# EAGLE schematic Pop-Up 5.3 (EAGLE 7.2.0)
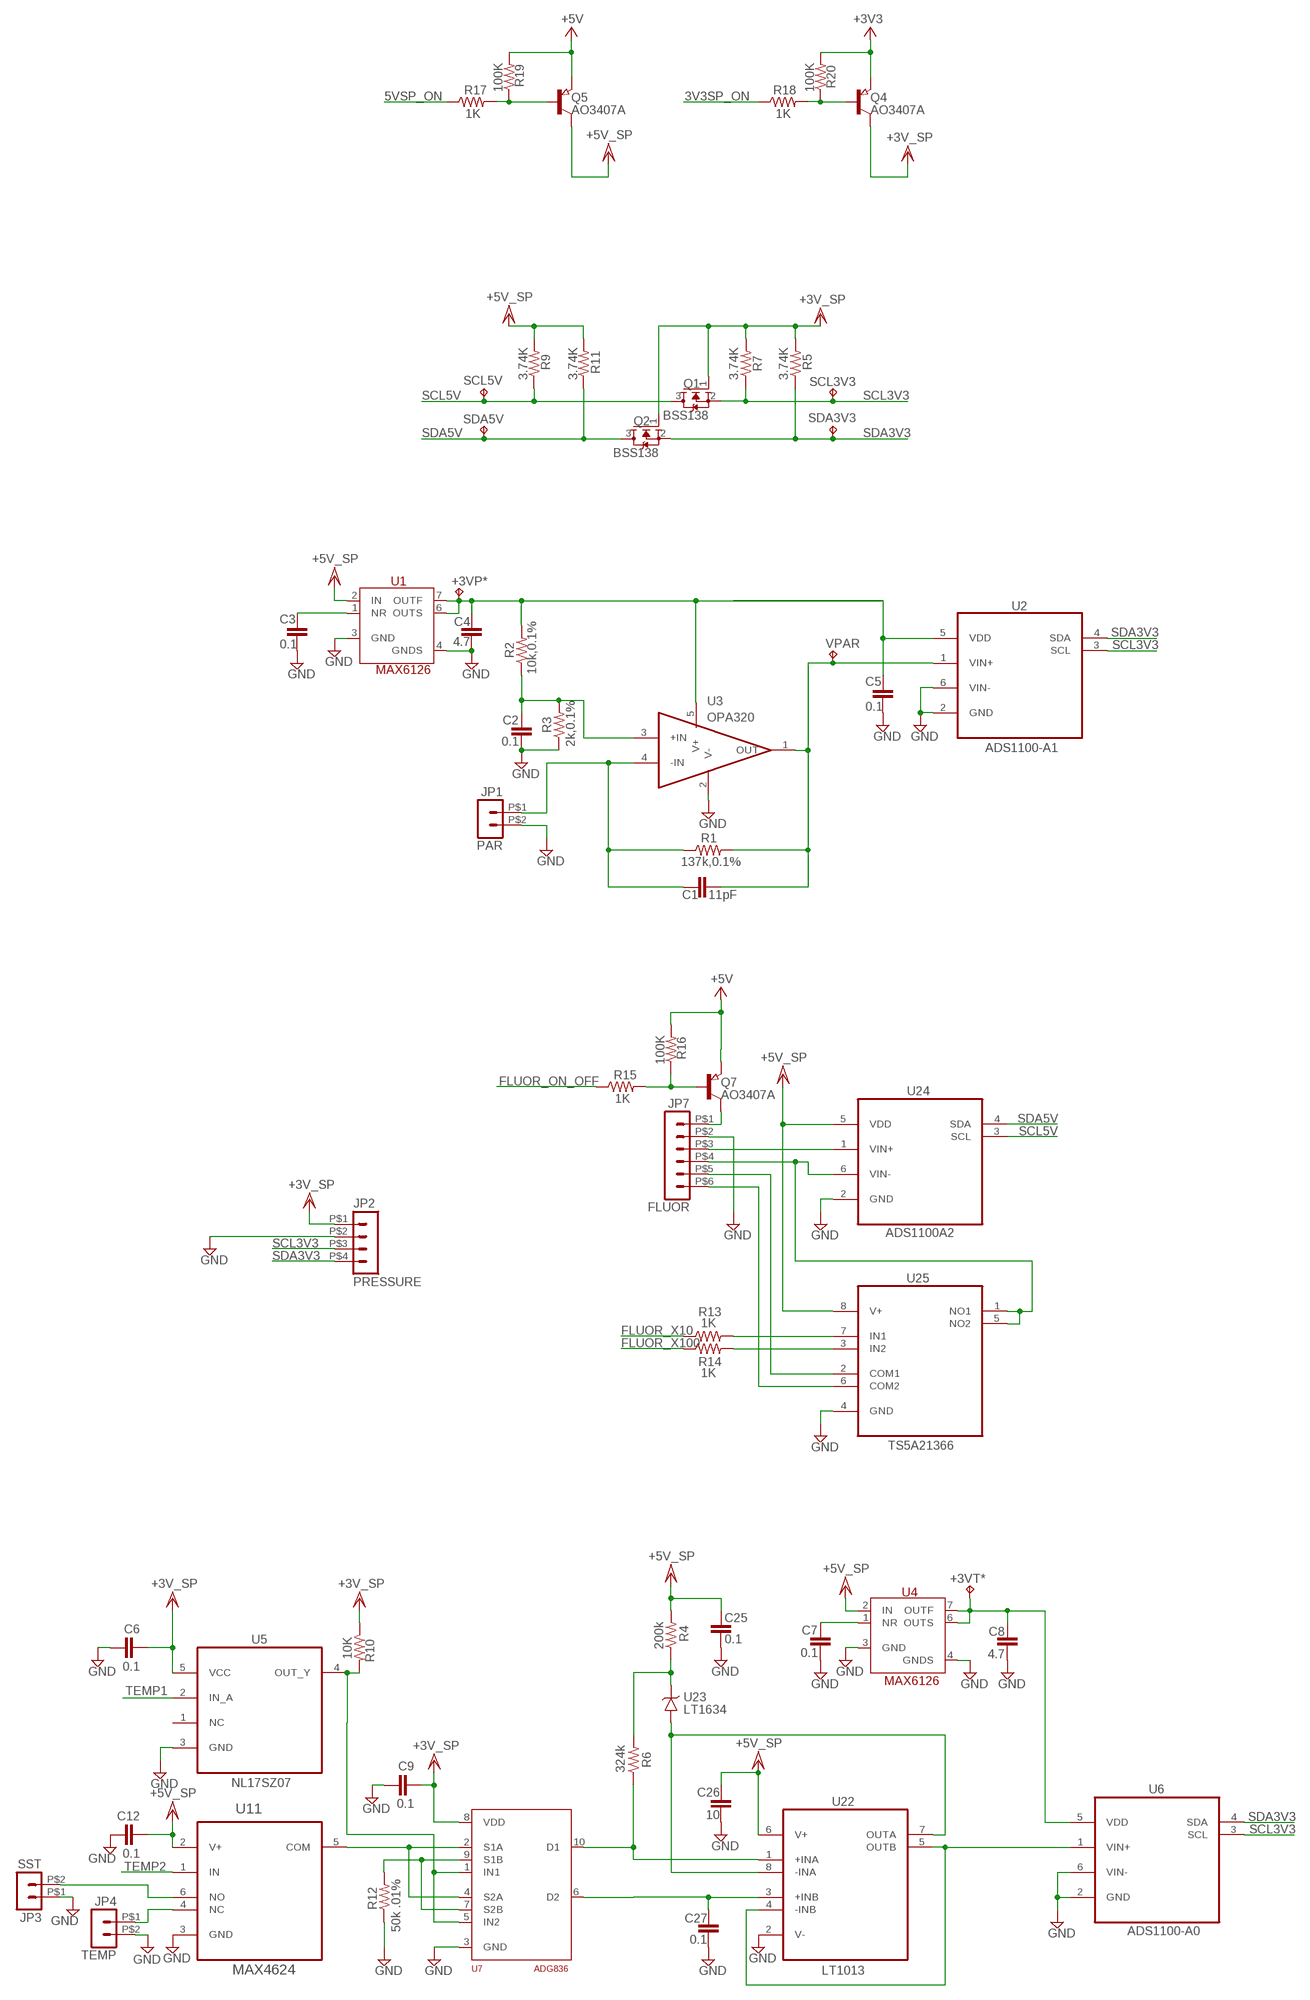
[diagram p0: schematic, sheet 1, part 1 of 2]
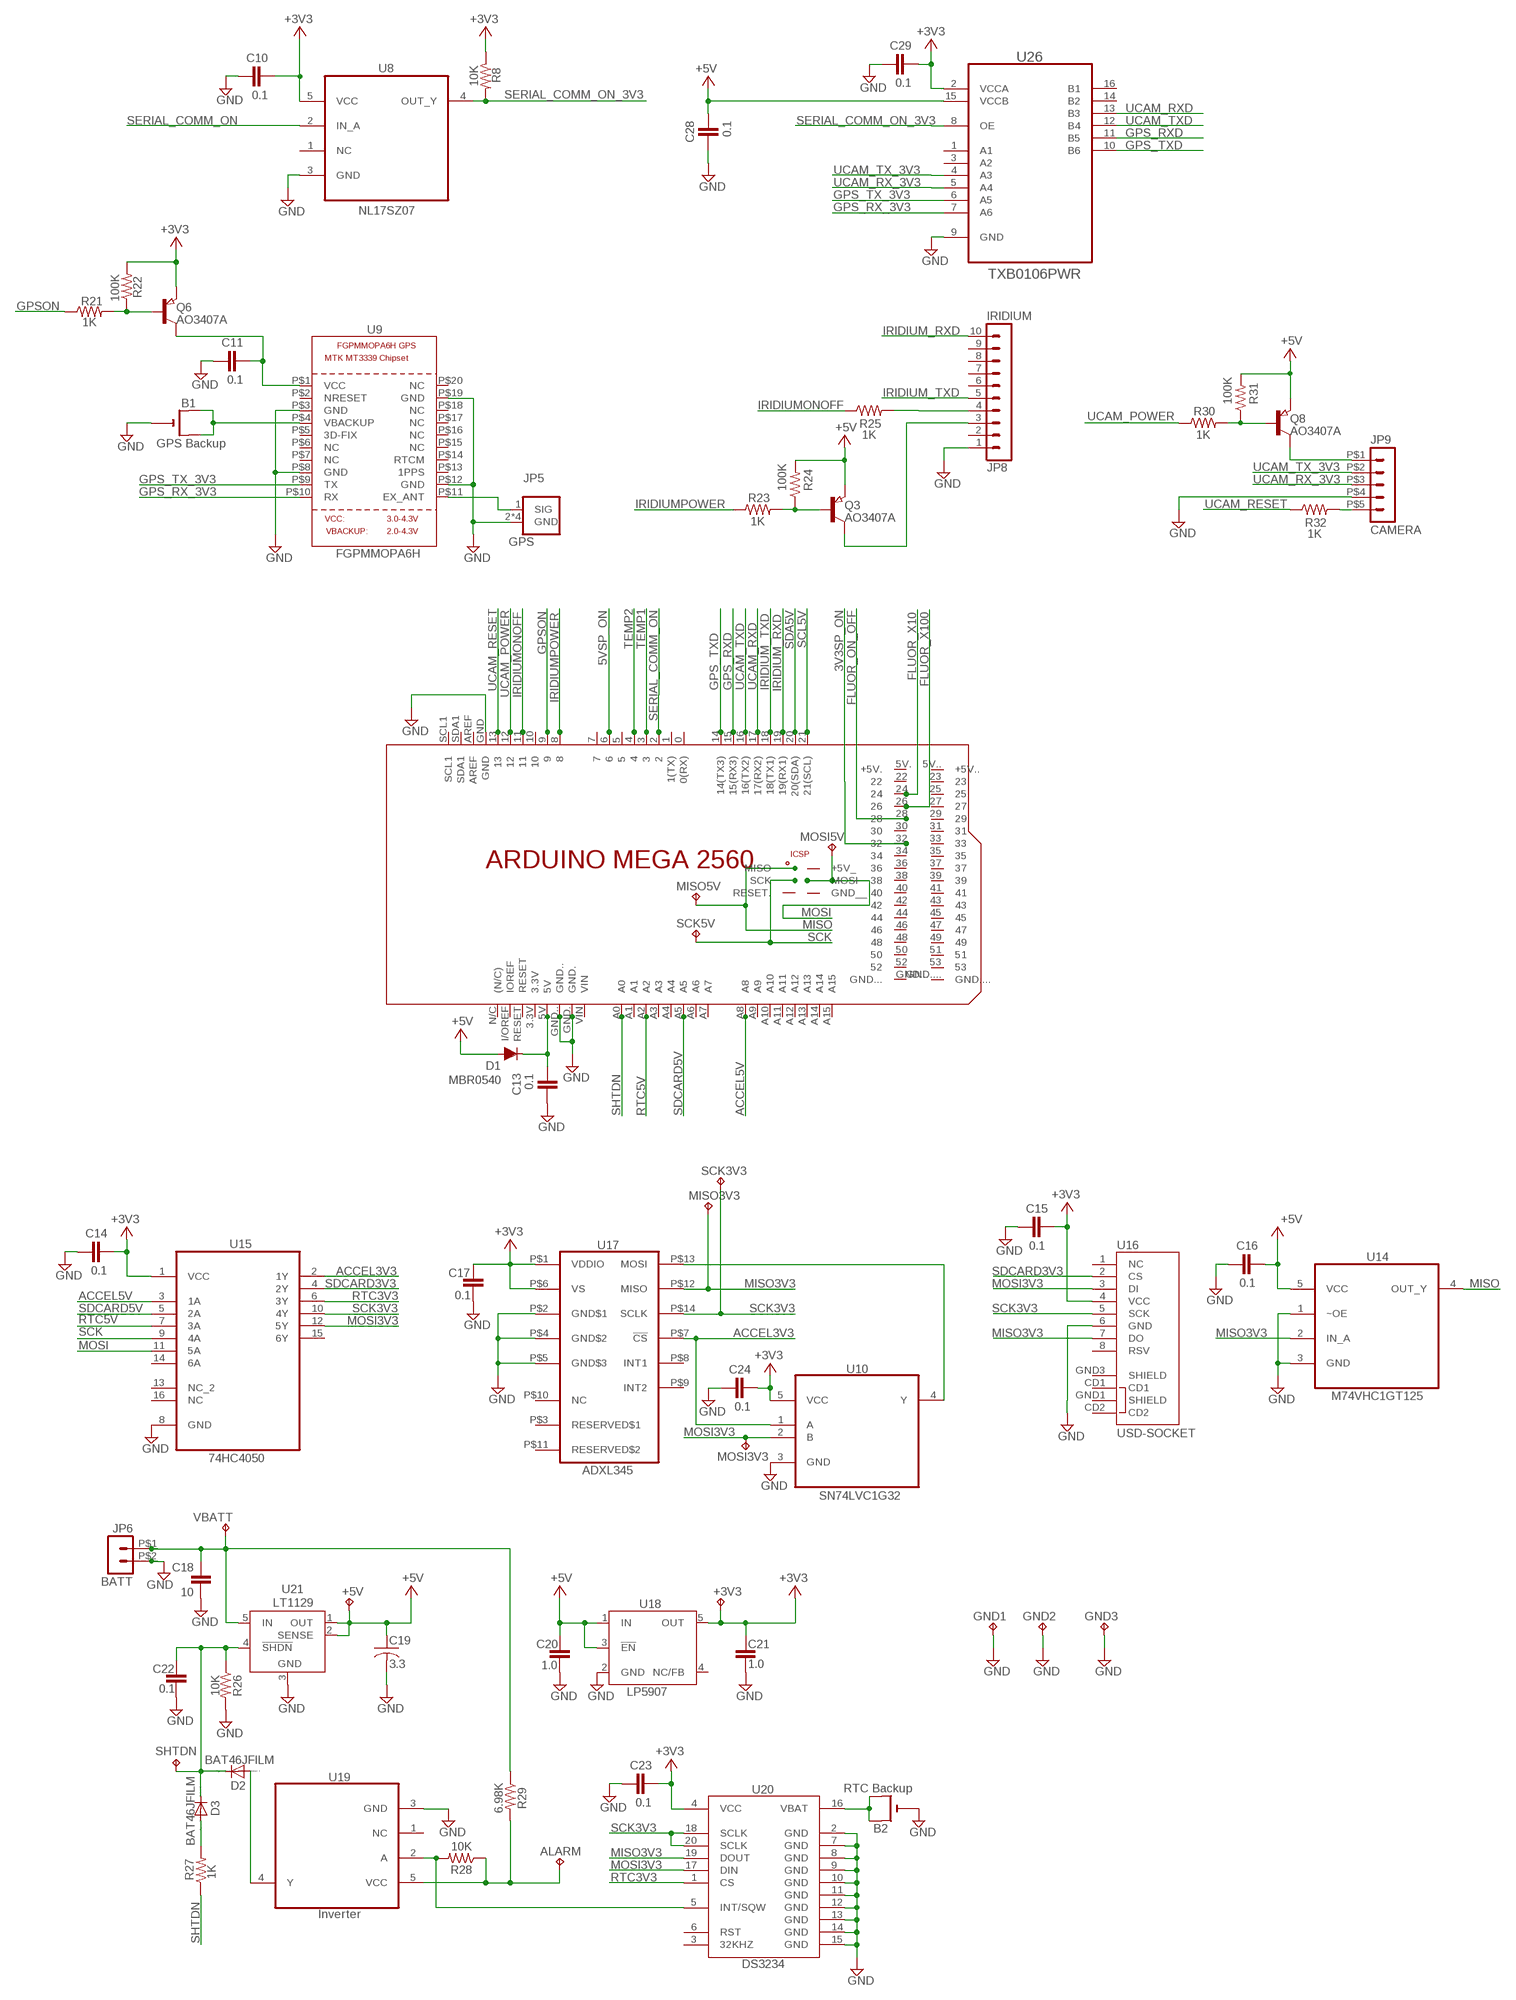
[diagram p1: schematic, sheet 1, part 2 of 2]

## Parts
+3V3  TP-040  [TP-040]
+3VP*  TP-040  [TP-040]
+3VT*  TP-040  [TP-040]
+5V  TP-040  [TP-040]
ALARM  TP-040  [TP-040]
B1  GPS Backup  CR1220SMT  [CR1220-SMD]
B2  RTC Backup  CR1220SMT  [CR1220-SMD]
C1  11pF  CAP0603-CAP  [0603-CAP]
C2  0.1  CAP0603-CAP  [0603-CAP]
C3  0.1  CAP0603-CAP  [0603-CAP]
C4  4.7  CAP0603-CAP  [0603-CAP]
C5  0.1  CAP0603-CAP  [0603-CAP]
C6  0.1  CAP0603-CAP  [0603-CAP]
C7  0.1  CAP0603-CAP  [0603-CAP]
C8  4.7  CAP0603-CAP  [0603-CAP]
C9  0.1  CAP0603-CAP  [0603-CAP]
C10  0.1  CAP0603-CAP  [0603-CAP]
C11  0.1  CAP0603-CAP  [0603-CAP]
C12  0.1  CAP0603-CAP  [0603-CAP]
C13  0.1  CAP0603-CAP  [0603-CAP]
C14  0.1  CAP0603-CAP  [0603-CAP]
C15  0.1  CAP0603-CAP  [0603-CAP]
C16  0.1  CAP0603-CAP  [0603-CAP]
C17  0.1  CAP0603-CAP  [0603-CAP]
C18  10  C-EUC1206  [C1206]
C19  3.3  C-USC1206  [C1206]
C20  1.0  CAP0603-CAP  [0603-CAP]
C21  1.0  CAP0603-CAP  [0603-CAP]
C22  0.1  CAP0603-CAP  [0603-CAP]
C23  0.1  CAP0603-CAP  [0603-CAP]
C24  0.1  CAP0603-CAP  [0603-CAP]
C25  0.1  CAP0603-CAP  [0603-CAP]
C26  10  C-EUC1206  [C1206]
C27  0.1  CAP0603-CAP  [0603-CAP]
C28  0.1  CAP0603-CAP  [0603-CAP]
C29  0.1  CAP0603-CAP  [0603-CAP]
D1  MBR0540  D-FILL-SOD123  [SOD123]
D2  BAT46JFILM  DIODE-SOD323-R  [SOD323-R]
D3  BAT46JFILM  DIODE-SOD323-R  [SOD323-R]
GND1  TP-040  [TP-040]
GND2  TP-040  [TP-040]
GND3  TP-040  [TP-040]
JP1  PAR  HEADER_POS2_43650-0215  [43650-0215]
JP2  PRESSURE  HEADER_POS4_43650-0415  [43650-0415]
JP3  SST  HEADER_POS2_43650-0215  [43650-0215]
JP4  TEMP  HEADER_POS2_43650-0215  [43650-0215]
JP5  GPS  901-9895-RFX  [AMPHENOL_901-9895-RFX]
JP6  BATT  HEADER_POS2_43650-0215  [43650-0215]
JP7  FLUOR  HEADER_POS6_43045-0612  [43045-0612]
JP8  IRIDIUM  53398-1010  [53398-1010]
JP9  CAMERA  HEADER_POS5_43650-0515  [43650-0515]
MISO3V3  TP-040  [TP-040]
MISO5V  TP-040  [TP-040]
MOSI3V3  TP-040  [TP-040]
MOSI5V  TP-040  [TP-040]
Q1  BSS138  MOSFET-NREFLOW  [SOT23]
Q2  BSS138  MOSFET-NREFLOW  [SOT23]
Q3  AO3407A  PNP-TRANSISTOR_SOT23  [SOT23]
Q4  AO3407A  PNP-TRANSISTOR_SOT23  [SOT23]
Q5  AO3407A  PNP-TRANSISTOR_SOT23  [SOT23]
Q6  AO3407A  PNP-TRANSISTOR_SOT23  [SOT23]
Q7  AO3407A  PNP-TRANSISTOR_SOT23  [SOT23]
Q8  AO3407A  PNP-TRANSISTOR_SOT23  [SOT23]
R1  137k,0.1%  R-US_R0603  [R0603]
R2  10k,0.1%  R-US_R0603  [R0603]
R3  2k,0.1%  R-US_R0603  [R0603]
R4  200k  R-US_R1206  [R1206]
R5  3.74K  R-US_R0603  [R0603]
R6  324k  R-US_R1206  [R1206]
R7  3.74K  R-US_R0603  [R0603]
R8  10K  R-US_R0603  [R0603]
R9  3.74K  R-US_R0603  [R0603]
R10  10K  R-US_R0603  [R0603]
R11  3.74K  R-US_R0603  [R0603]
R12  50k .01%  R-US_R2010  [R2010]
R13  1K  R-US_R0603  [R0603]
R14  1K  R-US_R0603  [R0603]
R15  1K  R-US_R0603  [R0603]
R16  100K  R-US_R0603  [R0603]
R17  1K  R-US_R0603  [R0603]
R18  1K  R-US_R0603  [R0603]
R19  100K  R-US_R0603  [R0603]
R20  100K  R-US_R0603  [R0603]
R21  1K  R-US_R0603  [R0603]
R22  100K  R-US_R0603  [R0603]
R23  1K  R-US_R0603  [R0603]
R24  100K  R-US_R0603  [R0603]
R25  1K  R-US_R0603  [R0603]
R26  10K  R-US_R0603  [R0603]
R27  1K  R-US_R0603  [R0603]
R28  10K  R-US_R0603  [R0603]
R29  6.98K  R-US_R0603  [R0603]
R30  1K  R-US_R0603  [R0603]
R31  100K  R-US_R0603  [R0603]
R32  1K  R-US_R0603  [R0603]
SCK3V3  TP-040  [TP-040]
SCK5V  TP-040  [TP-040]
SCL3V3  TP-040  [TP-040]
SCL5V  TP-040  [TP-040]
SDA3V3  TP-040  [TP-040]
SDA5V  TP-040  [TP-040]
SHTDN  TP-040  [TP-040]
U1  MAX6126  [SOIC127P600X175-8N]
U2  ADS1100-A1  ADS1100A0IDBVT  [SOT95P280X145-6N]
U3  OPA320  OPA320AIDBVT  [SOT95P280X145-5N]
U4  MAX6126  [SOIC127P600X175-8N]
U5  NL17SZ07  NL17SZ07DFT2G  [SOT65P210X110-5N]
U6  ADS1100-A0  ADS1100A0IDBVT  [SOT95P280X145-6N]
U7  ADG836  [MSOP10]
U8  NL17SZ07  NL17SZ07DFT2G  [SOT65P210X110-5N]
U9  FGPMMOPA6H  GPS_FGPMMOPA6H  [FGPMMOPA6H]
U10  SN74LVC1G32  SN74LVC1G32DCKT  [SOT65P210X110-5N]
U11  MAX4624  MAX4624EZT+T  [SOT95P275X100-6N]
U12  Arduino MEGA2650  MEGA2650_UPSIDEDOWNMOUNT  [MEGA2650_UPSIDEDOWNMOUNT]
U14  M74VHC1GT125  M74VHC1GT125DF1G  [SOT65P210X110-5N]
U15  74HC4050  M74HC4050RM13TR  [SOIC127P600X175-16N]
U16  USD-SOCKET  [MICROSD_1:1]
U17  ADXL345  [LGA14]
U18  LP5907  TPS77033  [SOT23-DBV]
U19  Inverter  1P1G14MDBVREPG4  [SOT95P280X145-5N]
U20  DS3234  [DS3234]
U21  LT1129  LT1129CQ-5  [Q5-DD]
U22  LT1013  LT1013IS8PBF  [SOIC127P600X175-8N]
U23  LT1634  LT1634BIS8-1.25  [S8]
U24  ADS1100A2  ADS1100A2IDBVT  [SOT95P280X145-6N]
U25  TS5A21366  TS5A21366DCUR  [SOP50P310X90-8N]
U26  TXB0106PWR  [SOP65P640X120-16N]
VBATT  TP-040  [TP-040]
VPAR  TP-040  [TP-040]

## Nets
3V3SP_ON: R18.1 U12.32
5VSP_ON: R17.1 U12.6
+3V3: +3V3.1 C10.1 C14.1 C15.1 C17.1 C21.1 C23.1 C24.1 C29.1 Q4.2(E) Q6.2(E) R8.1 R20.2 R22.2 U8.5(VCC) U10.5(VCC) U15.1(VCC) U16.4(VCC) U17.P$1(VDDIO) U17.P$6(VS) U18.5(OUT) U20.4(VCC) U26.2(VCCA)
+5V: +5V.1 C16.1 C19.1 C20.1 C28.1 D1.2(A) Q3.2(E) Q5.2(E) Q7.2(E) Q8.2(E) R16.2 R19.2 R24.2 R31.2 U14.5(VCC) U18.1(IN) U18.3(!EN) U21.1(OUT) U21.2(SENSE) U26.15(VCCB)
ACCEL3V3: U10.1(A) U15.2(1Y) U17.P$7(!CS)
ACCEL5V: U12.A8 U15.3(1A)
FLUOR_ON_OFF: R15.1 U12.28
FLUOR_X10: R13.1 U12.24
FLUOR_X100: R14.1 U12.26
GND: B1.- B2.- C2.2 C3.2 C4.2 C5.1 C6.2 C7.2 C8.2 C9.2 C10.2 C11.2 C12.2 C13.2 C14.2 C15.2 C16.2 C17.2 C18.2 C19.2 C20.2 C21.2 C22.2 C23.2 C24.2 C25.2 C26.2 C27.2 C28.2 C29.2 GND1.1 GND2.1 GND3.1 JP1.P$2 JP2.P$2 JP3.P$1 JP4.P$2 JP5.2(GND) JP5.3(GND) JP5.4(GND) JP5.5(GND) JP6.P$2 JP7.P$2 JP8.1 JP9.P$4 R3.1 R12.1 R26.2 U1.3(GND) U1.4(GNDS) U2.2(GND) U2.6(VIN-) U3.2(V-) U4.3(GND) U4.4(GNDS) U5.3(GND) U6.2(GND) U6.6(VIN-) U7.3(GND) U8.3(GND) U9.P$3(GND) U9.P$8(GND) U9.P$12(GND) U9.P$19(GND) U10.3(GND) U11.3(GND) U12.GND U12.GND. U12.GND.. U14.1(~OE) U14.3(GND) U15.8(GND) U16.6(GND) U17.P$2(GND$1) U17.P$4(GND$2) U17.P$5(GND$3) U18.2(GND) U19.3(GND) U20.2(GND) U20.7(GND) U20.8(GND) U20.9(GND) U20.10(GND) U20.11(GND) U20.12(GND) U20.13(GND) U20.14(GND) U20.15(GND) U21.3(GND) U22.2(V-) U24.2(GND) U25.4(GND) U26.9(GND)
GPS_RX_3V3: U9.P$10(RX) U26.7(A6)
GPS_RXD: U12.15(15(RX3)) U26.11(B5)
GPS_TX_3V3: U9.P$9(TX) U26.6(A5)
GPS_TXD: U12.14(14(TX3)) U26.10(B6)
GPSON: R21.1 U12.9
IRIDIUM_RXD: JP8.10 U12.19(19(RX1))
IRIDIUM_TXD: JP8.5 U12.18(18(TX1))
IRIDIUMONOFF: R25.1 U12.11
IRIDIUMPOWER: R23.1 U12.8
MISO: MISO5V.1 U12.MISO U14.4(OUT_Y)
MISO3V3: MISO3V3.1 U14.2(IN_A) U16.7(DO) U17.P$12(MISO) U20.19(DOUT)
MOSI: MOSI5V.1 U12.MOSI U15.11(5A)
MOSI3V3: MOSI3V3.1 U10.2(B) U15.12(5Y) U16.3(DI) U20.17(DIN)
N$1: D2.A U19.4(Y)
N$2: Q3.1(B) R23.2 R24.1
N$3: ALARM.1 R28.1 R29.2 U19.5(VCC)
N$4: JP8.4 R25.2
N$5: C7.1 U4.1(NR)
N$6: C13.1 D1.1(C) U12.5V
N$7: U7.2(S1A) U7.4(S2A) U11.5(COM)
N$9: JP8.3 Q3.3(C)
N$10: JP5.1(SIG) U9.P$11(EX_ANT)
N$11: +3VT*.1 C8.1 U4.6(OUTS) U4.7(OUTF) U6.5(VDD)
N$12: R4.1 R6.2 U23.6(VOUT)
N$13: U22.7(OUTA) U22.8(-INA) U23.4(GND)
N$14: B1.+$1(+) B1.+$2(+1) U9.P$4(VBACKUP)
N$15: Q6.1(B) R21.2 R22.1
N$16: B2.+$1(+) B2.+$2(+1) U20.16(VBAT)
N$17: R28.2 U19.2(A) U20.5(INT/SQW)
N$18: U6.1(VIN+) U22.4(-INB) U22.5(OUTB)
N$19: C11.1 Q6.3(C) U9.P$1(VCC)
N$20: JP7.P$3 U24.1(VIN+)
N$21: R13.2 U25.7(IN1)
N$22: JP7.P$5 U25.2(COM1)
N$23: +3VP*.1 C4.1 C5.2 R2.2 U1.6(OUTS) U1.7(OUTF) U2.5(VDD) U3.5(V+)
N$24: C3.1 U1.1(NR)
N$25: C1.2 R1.2 U2.1(VIN+) U3.1(OUT) VPAR.1
N$26: JP4.P$1 U11.4(NC)
N$28: C2.1 R2.1 R3.2 U3.3(+IN)
N$29: JP7.P$6 U25.6(COM2)
N$30: C1.1 JP1.P$1 R1.1 U3.4(-IN)
N$31: C22.1 D2.C D3.C R26.1 SHTDN.1 U21.4(!SHDN)
N$32: Q5.1(B) R17.2 R19.1
N$33: Q4.1(B) R18.2 R20.1
N$34: R14.2 U25.3(IN2)
N$35: U10.4(Y) U17.P$13(MOSI)
N$36: R6.1 U7.10(D1) U22.1(+INA)
N$37: Q7.1(B) R15.2 R16.1
N$38: JP7.P$4 U24.6(VIN-) U25.1(NO1) U25.5(NO2)
N$39: Q8.1(B) R30.2 R31.1
N$40: JP7.P$1 Q7.3(C)
N$41: JP9.P$1 Q8.3(C)
N$42: C27.1 U7.6(D2) U22.3(+INB)
N$43: JP9.P$5 R32.2
N$44: D3.A R27.2
N$45: JP3.P$2 U11.6(NO)
N$46: R10.2 U5.4(OUT_Y) U7.1(IN1) U7.5(IN2)
N$47: R12.2 U7.7(S2B) U7.9(S1B)
RTC3V3: U15.6(3Y) U20.1(CS)
RTC5V: U12.A2 U15.7(3A)
SCK: SCK5V.1 U12.SCK U15.9(4A)
SCK3V3: SCK3V3.1 U15.10(4Y) U16.5(SCK) U17.P$14(SCLK) U20.18(SCLK) U20.20(SCLK)
SCL3V3: JP2.P$3 Q1.2(S) R7.1 SCL3V3.1 U2.3(SCL) U6.3(SCL)
SCL5V: Q1.3(D) R9.1 SCL5V.1 U12.21(21(SCL)) U24.3(SCL)
SDA3V3: JP2.P$4 Q2.2(S) R5.1 SDA3V3.1 U2.4(SDA) U6.4(SDA)
SDA5V: Q2.3(D) R11.1 SDA5V.1 U12.20(20(SDA)) U24.4(SDA)
SDCARD3V3: U15.4(2Y) U16.2(CS)
SDCARD5V: U12.A5 U15.5(2A)
SERIAL_COMM_ON: U8.2(IN_A) U12.2
SERIAL_COMM_ON_3V3: R8.2 U8.4(OUT_Y) U26.8(OE)
SHTDN: R27.1 U12.A0
TEMP1: U5.2(IN_A) U12.3
TEMP2: U11.1(IN) U12.4
UCAM_POWER: R30.1 U12.12
UCAM_RESET: R32.1 U12.13
UCAM_RX_3V3: JP9.P$3 U26.5(A4)
UCAM_RXD: U12.17(17(RX2)) U26.13(B3)
UCAM_TX_3V3: JP9.P$2 U26.4(A3)
UCAM_TXD: U12.16(16(TX2)) U26.12(B4)
VBATT: C18.1 JP6.P$1 R29.1 U21.5(IN) VBATT.1
VCC/2: C12.1 C25.1 C26.1 Q5.3(C) R4.2 R9.2 R11.2 U1.2(IN) U4.2(IN) U11.2(V+) U22.6(V+) U24.5(VDD) U25.8(V+) ; supply symbol labelled +5V_SP
VDD: C6.1 C9.1 JP2.P$1 Q1.1(G) Q2.1(G) Q4.3(C) R5.2 R7.2 R10.1 U5.5(VCC) U7.8(VDD) ; supply symbol labelled +3V_SP
Unconnected: JP8.2 JP8.6 JP8.7 JP8.8 JP8.9 U5.1(NC) U8.1(NC) U9.P$2(NRESET) U9.P$5(3D-FIX) U9.P$6(NC) U9.P$7(NC) U9.P$13(1PPS) U9.P$14(RTCM) U9.P$15(NC) U9.P$16(NC) U9.P$17(NC) U9.P$18(NC) U9.P$20(NC) U12.0(0(RX)) U12.1(1(TX)) U12.3.3V U12.5 U12.5V.(+5V.) U12.5V..(+5V..) U12.7 U12.10 U12.22 U12.23 U12.25 U12.27 U12.29 U12.30 U12.31 U12.33 U12.34 U12.35 U12.36 U12.37 U12.38 U12.39 U12.40 U12.41 U12.42 U12.43 U12.44 U12.45 U12.46 U12.47 U12.48 U12.49 U12.50 U12.51 U12.52 U12.53 U12.+5V_ U12.A1 U12.A3 U12.A4 U12.A6 U12.A7 U12.A9 U12.A10 U12.A11 U12.A12 U12.A13 U12.A14 U12.A15 U12.AREF U12.GND... U12.GND.... U12.GND__ U12.I/OREF(IOREF) U12.N/C((N/C)) U12.RESET U12.RESET. U12.SCL1 U12.SDA1 U12.VIN U15.13(NC_2) U15.14(6A) U15.15(6Y) U15.16(NC) U16.1(NC) U16.8(RSV) U16.CD1 U16.CD2 U16.GND1(SHIELD) U16.GND3(SHIELD) U17.P$3(RESERVED$1) U17.P$8(INT1) U17.P$9(INT2) U17.P$10(NC) U17.P$11(RESERVED$2) U18.4(NC/FB) U19.1(NC) U20.3(32KHZ) U20.6(RST) U26.1(A1) U26.3(A2) U26.14(B2) U26.16(B1)

## Library data of the parts
+3V3 +3VP* +3VT* +5V ALARM GND1-GND3 MISO3V3 MISO5V MOSI3V3 MOSI5V SCK3V3 SCK5V SCL3V3 SCL5V SDA3V3 SDA5V SHTDN VBATT VPAR = keystone:TP: TEST POINT PCB Vertical Mount; OC_NEWARK: unknown
B1 B2 = adafruit:CR1220: CR1216/CR1220/CR1225 12mm 3V lithium coin cell Great for battery packup. Both SMT and THM holders. Note the THM package has the ground pads on both sides of the PCB so that the masks are the same - this reduces the cost
C1-C17 C20-C25 C27-C29 = SparkFun-Capacitors:CAP: Capacitor Standard 0603 ceramic capacitor, and 0.1" leaded capacitor.; MPN: 2222 370 21104; OC_NEWARK: 98K6987
C18 = rcl:C-EU: CAPACITOR, European symbol
C19 = rcl:C-US: CAPACITOR, American symbol
C26 = rcl:C-EU: CAPACITOR, European symbol; MPN: 2222 370 21104; OC_NEWARK: 98K6987
D1 = semicon-smd-ipc:D-FILL-: DIODE filled
D2 D3 = diode:DIODE-: DIODE; OC_NEWARK: unknown
JP1 JP3 JP4 JP6 = con-molex-micro-fit-3_0:HEADER_POS2_?: Molex - Micro-Fit 3.0 Series connector, 3.00mm (0.118") pitch header, 2 positions.
JP2 = con-molex-micro-fit-3_0:HEADER_POS4_?: Molex - Micro-Fit 3.0 Series connector, 3.00mm (0.118") pitch header, 4 positions.
JP5 = Amphenol_By_element14_Batch_1:901-9895-RFX: RF/COAXIAL, SMA JACK, STR, 50OHM, SOLDER; MPN: 901-9895-RFX; OC_FARNELL: -; OC_NEWARK: 83F6735; PACKAGE: RF/COAXIAL, SMA JACK, STR, 50OHM, SOLDER; SUPPLIER: Amphenol
JP7 = con-molex-micro-fit-3_0:HEADER_POS6_?: Molex - Micro-Fit 3.0 Series connector, 3.00mm (0.118") pitch header, 6 positions.
JP8 = con-molex-picoblade:53398-1010: HEADER
JP9 = con-molex-micro-fit-3_0:HEADER_POS5_?: Molex - Micro-Fit 3.0 Series connector, 3.00mm (0.118") pitch header, 5 positions.
Q1 Q2 = adafruit:MOSFET-N: N-Channel Mosfet 2N7002E - 60V 260mA SOT23 [Digikey: 2N7002ET1GOSTR-ND] - REEL BSH103 - 30V 850mA SOT23 [Digikey: 568-5013-1-ND]
Q3-Q8 = semicon-smd-ipc:PNP-TRANSISTOR_: PNP TRANSISTOR
R1-R11 R13-R32 = resistor:R-US_: RESISTOR, American symbol; OC_NEWARK: unknown
R12 = resistor:R-US_: RESISTOR, American symbol
U1 U4 = Maxim_By_element14_Batch_1:MAX6126
U2 U6 = Texas Instruments_By_element14_Batch_1:ADS1100A0IDBVT: Self-Calibrating, 16-Bit ANALOG-TO-DIGITAL CONVERTER; MPN: ADS1100A0IDBVT; OC_FARNELL: 1135959; OC_NEWARK: 20H0708; PACKAGE: SOT-23-6; SUPPLIER: Texas Instruments
U3 = Texas Instruments_By_element14_Batch_1:OPA320AIDBVT: Operational Amplifier; MPN: OPA320AIDBVT; OC_FARNELL: 2057093; OC_NEWARK: 64T3764; PACKAGE: SOT-23-5; SUPPLIER: Texas Instruments
U5 U8 = ON Semiconductor_By_element14_Batch_1:NL17SZ07DFT2G: Single Non-Inverting Buffer with Open Drain Output; MPN: NL17SZ07DFT2G; OC_FARNELL: 1705431; OC_NEWARK: 04R7799; PACKAGE: SOT-353-5; SUPPLIER: ON Semiconductor
U7 = analog-devices:ADG836
U9 = adafruit:GPS_FGPMMOPA6H: GPS Module - MTK MT3339 Chipset, -165dBm sensitivity, 22 channels, 10Hz, auto-select external antenna options
U10 = Texas Instruments_By_element14_Batch_1:SN74LVC1G32DCKT: SINGLE 2-INPUT POSITIVE-OR GATE; MPN: SN74LVC1G32DCKT; OC_FARNELL: 1236340; OC_NEWARK: 22H0383; PACKAGE: SC70-5; SUPPLIER: Texas Instruments
U11 = Maxim_By_element14_Batch_1:MAX4624EZT+T: 1Ù, Low-Voltage, Single-Supply SPDT Analog Switches; MPN: MAX4624EZT+T; OC_FARNELL: 1894647; OC_NEWARK: 68K9437; PACKAGE: SOT-23-6; SUPPLIER: Maxim
U12 = E14_Arduino_revB:MEGA2650_UPSIDEDOWNMOUNT
U14 = ON Semiconductor_By_element14_Batch_1:M74VHC1GT125DF1G: Noninverting Buffer / CMOS Logic Level Shifter; MPN: M74VHC1GT125DF1G; OC_FARNELL: 1567363; OC_NEWARK: 83H7591; PACKAGE: SOT-23-5; SUPPLIER: ON SEMICONDUCTOR
U15 = ST Microelctronics_By_element14_Batch_1:M74HC4050RM13TR: HEX BUFFER/CONVERTER; MPN: M74HC4050RM13TR; OC_FARNELL: 1261257; OC_NEWARK: 89K0905; PACKAGE: SOIC-16; SUPPLIER: STMICROELECTRONICS
U16 = SparkFun-Connectors:USD-SOCKET: microSD Socket Push-push type uSD socket. Schematic element and footprint production proven. Spark Fun Electronics SKU : PRT-00127. tDoc lines correctly indicate media card edge positions when inserting (unlocked, locked, depressed). NOTE: CD1 and CD2 are connected internally; PROD_ID: CONN-07820
U17 = adxl345:ADXL345: 3-Axis, ±2 g/±4 g/±8 g/±16 g Digital Accelerometer
U18 = texas:TPS770*: ULTRALOW-POWER 50-mA LOW-DROPOUT LINEAR REGULATORS 50-mA Low-Dropout Regulator Source: http://focus.ti.com/lit/ds/symlink/tps77001.pdf; MF: TEXAS INSTRUMENTS; MPN: TPS77033DBVT; OC_FARNELL: 8461570; OC_NEWARK: 77C1187
U19 = Texas Instruments_By_element14_Batch_1:1P1G14MDBVREPG4: SINGLE SCHMITT-TRIGGER INVERTER; MPN: 1P1G14MDBVREPG4; OC_FARNELL: -; OC_NEWARK: unknown; PACKAGE: SOT-23-5; SUPPLIER: Texas Instruments
U20 = SparkFun-FreqCtrl:DS3234: SPI RTC module with battery backup and internal clock.
U21 = linear-technology:LT1129CQ-5: VOLTAGE REGULATOR with shutdown; MPN: LT1129CQ-5#PBF; OC_FARNELL: 1663373; OC_NEWARK: 57M2058
U22 = LTC_By_element14_Batch_1:LT1013IS8PBF: Dual Precision Op Amp; MPN: LT1013IS8#PBF; OC_FARNELL: 1556424; OC_NEWARK: 57M0833; PACKAGE: SOIC-8; SUPPLIER: Linear Technology
U23 = linear-technology:LT1634: Micropower Precision Shunt Voltage Reference Source: Darta sheet <http://cds.linear.com/docs/en/datasheet/1634fe.pdf>
U24 = Texas Instruments_By_element14_Batch_1:ADS1100A2IDBVT: Self-Calibrating, 16-Bit ANALOG-TO-DIGITAL CONVERTER; MPN: ADS1100A2IDBVT; OC_FARNELL: 1206858; OC_NEWARK: 20H0712; PACKAGE: SOT-23-6; SUPPLIER: Texas Instruments
U25 = Texas Instruments_By_element14_Batch_1:TS5A21366DCUR: 0.75-Ù DUAL SPST ANALOG SWITCH WITH 1.8-V COMPATIBLE INPUT LOGIC; MPN: TS5A21366DCUR; OC_FARNELL: 1710838; OC_NEWARK: 04R6571; PACKAGE: SOP-8; SUPPLIER: Texas Instruments
U26 = Texas Instruments_By_element14_Batch_1:TXB0106PWR: VOLTAGE-LEVEL TRANSLATOR; MPN: TXB0106PWR; OC_FARNELL: 1694679; OC_NEWARK: 46P3786; PACKAGE: TSSOP-16; SUPPLIER: Texas Instruments